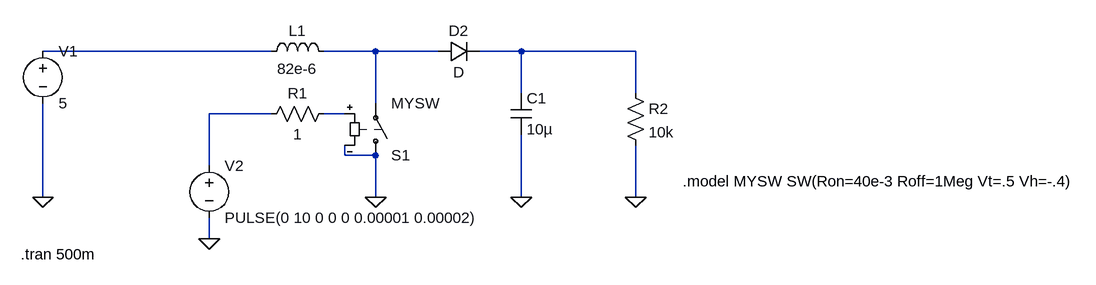
[diagram p0: schematic SimpleBoost.asc]
SimpleBoost.asc, the LTspice schematic file:
Version 4
SHEET 1 1480 680
WIRE 192 128 -160 128
WIRE 352 128 272 128
WIRE 448 128 352 128
WIRE 576 128 512 128
WIRE 752 128 576 128
WIRE 576 192 576 128
WIRE 752 192 752 128
WIRE 352 208 352 128
WIRE 192 224 96 224
WIRE 304 224 272 224
WIRE 304 288 304 272
WIRE 352 288 304 288
WIRE 96 304 96 224
WIRE -160 352 -160 208
WIRE 352 352 352 288
WIRE 576 352 576 256
WIRE 752 352 752 272
WIRE 96 416 96 384
FLAG 352 352 0
FLAG 576 352 0
FLAG 752 352 0
FLAG -160 352 0
FLAG 96 416 0
SYMBOL ind 176 144 R270
WINDOW 0 32 56 VTop 2
WINDOW 3 5 56 VBottom 2
SYMATTR InstName L1
SYMATTR Value 82e-6
SYMBOL res 288 208 R90
WINDOW 0 0 56 VBottom 2
WINDOW 3 32 56 VTop 2
SYMATTR InstName R1
SYMATTR Value 1
SYMBOL cap 560 192 R0
SYMATTR InstName C1
SYMATTR Value 10µ
SYMBOL res 736 176 R0
SYMATTR InstName R2
SYMATTR Value 10k
SYMBOL voltage -160 112 R0
SYMATTR InstName V1
SYMATTR Value 5
SYMBOL voltage 96 288 R0
WINDOW 123 0 0 Left 0
WINDOW 39 0 0 Left 0
SYMATTR InstName V2
SYMATTR Value PULSE(0 10 0 0 0 0.00001 0.00002)
SYMBOL sw 352 304 M180
SYMATTR InstName S1
SYMATTR Value MYSW
SYMBOL diode 448 144 R270
WINDOW 0 32 32 VTop 2
WINDOW 3 0 32 VBottom 2
SYMATTR InstName D2
TEXT -194 440 Left 2 !.tran 500m
TEXT 824 328 Left 2 !.model MYSW SW(Ron=40e-3 Roff=1Meg Vt=.5 Vh=-.4)

The netlist it stands for:
* SimpleBoost.asc
L1 N001 N002 82e-6
R1 N005 N004 1
C1 N003 0 10µ
R2 N003 0 10k
V1 N001 0 5
V2 N004 0 PULSE(0 10 0 0 0 0.00001 0.00002)
S1 0 N002 N005 0 MYSW
D2 N002 N003 D
.model D D
.lib standard.dio
.tran 500m
.model MYSW SW(Ron=40e-3 Roff=1Meg Vt=.5 Vh=-.4)
.backanno
.end